# Altium schematic sheet TOFSensorControl.SchDoc
size A4
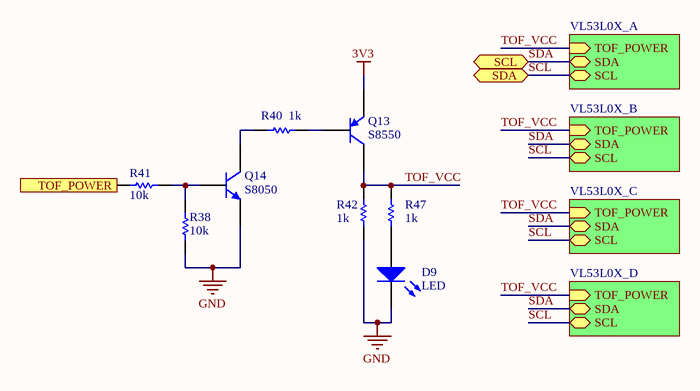
[diagram p0: TOFSensorControl.SchDoc]

## Parts
D9  LED  [J1-0603 LED]
Q13  S8550  [SOT23-3M]
Q14  S8050  [SOT23-3M]
R38  value 10k  [J1-0603]  (hidden comment: Res1)
R40  value 1k  [J1-0603]  (hidden comment: Res1)
R41  value 10k  [J1-0603]  (hidden comment: Res1)
R42  value 1k  [J1-0603]  (hidden comment: Res1)
R47  value 1k  [J1-0603]  (hidden comment: Res1)

## Sub-sheets
VL53L0X_A = TOFSensor.SchDoc: SDA (bidir), SCL (bidir), TOF_POWER (in)  | R_VALUE: 0
VL53L0X_B = TOFSensor.SchDoc: SCL (bidir), TOF_POWER (in), SDA (bidir)  | R_VALUE: 10k
VL53L0X_C = TOFSensor.SchDoc: SCL (bidir), TOF_POWER (in), SDA (bidir)  | R_VALUE: 20k
VL53L0X_D = TOFSensor.SchDoc: SCL (bidir), TOF_POWER (in), SDA (bidir)  | R_VALUE: 30k

## Ports
SCL (bidir), SDA (bidir), TOF_POWER (in)

## Nets
3V3: Q13.2(E)
GND: D9.2(K) Q14.2(E) R38.2 R42.1
SCL: port SDA, sheet VL53L0X_A/SCL, sheet VL53L0X_B/SCL, sheet VL53L0X_C/SCL, sheet VL53L0X_D/SCL
SDA: port SCL, sheet VL53L0X_A/SDA, sheet VL53L0X_B/SDA, sheet VL53L0X_C/SDA, sheet VL53L0X_D/SDA
TOF_POWER: R41.2 ; port TOF_POWER
TOF_VCC: Q13.3(C) R42.2 R47.2 ; sheet VL53L0X_A/TOF_POWER, sheet VL53L0X_B/TOF_POWER, sheet VL53L0X_C/TOF_POWER, sheet VL53L0X_D/TOF_POWER
NetD9_1: D9.1(A) R47.1
NetQ13_1: Q13.1(B) R40.1
NetQ14_1: Q14.1(B) R38.1 R41.1
NetQ14_3: Q14.3(C) R40.2

## Library data of the parts
Q13 = S8550: PNP General Purpose Amplifier; Published: 8-Jun-2000; LatestRevisionDate: 15-Jan-2003; LatestRevisionNote: PCB Footprint 'BCY-W3/D4.7' replaced; DatasheetVersion: 1997; PackageVersion: Sep-1998; PackageReference: TO-92A; Publisher: Altium Limited; PackageDescription: TO, Flat Index; 3 In-Line, Axial Leads; Body Dia. 4.5mm; Leads 0.51 x 0.48 mm (max); LCSC: C111271
Q14 = S8050: NPN General Purpose Amplifier; Published: 8-Jun-2000; LatestRevisionDate: 15-Jan-2003; LatestRevisionNote: PCB Footprint 'BCY-W3/D4.7' replaced; DatasheetVersion: 1997; PackageVersion: Sep-1998; PackageReference: TO-92A; Publisher: Altium Limited; PackageDescription: TO, Flat Index; 3 In-Line, Axial Leads; Body Dia. 4.5mm; Leads 0.51 x 0.48 mm (max); LCSC: C259988
R38 R40-R42 R47 = Res1: Resistor; Published: 8-Jun-2000; LatestRevisionDate: 17-Jul-2002; LatestRevisionNote: Re-released for DXP Platform.; PackageReference: AXIAL-0.3; Publisher: Altium Limited; PackageDescription: Axial Device, Thru-Hole; 2 Leads; 0.3 in Pin Spacing
D9 = LED: Published: 8-Jun-2000; LatestRevisionDate: 17-Jul-2002; LatestRevisionNote: Re-released for DXP Platform.; PackageVersion: Feb-2002; PackageReference: 3.2X1.6X1.1; Publisher: Altium Limited; PackageDescription: SM LED; 2 Flat Leads; LCSC: C205450